# EasyEDA Pro project 遥控器(433+红外).eprj

# Schematic Schematic1

## Sheets
1 P1: Create Date: 2022-12-18; Page Name: P1; Project Name: 遥控器(433+红外); Schematic Name: Schematic1; Update Date: 2022-12-21; Company: 嘉立创EDA; Page Size: A4; Version: V1.0
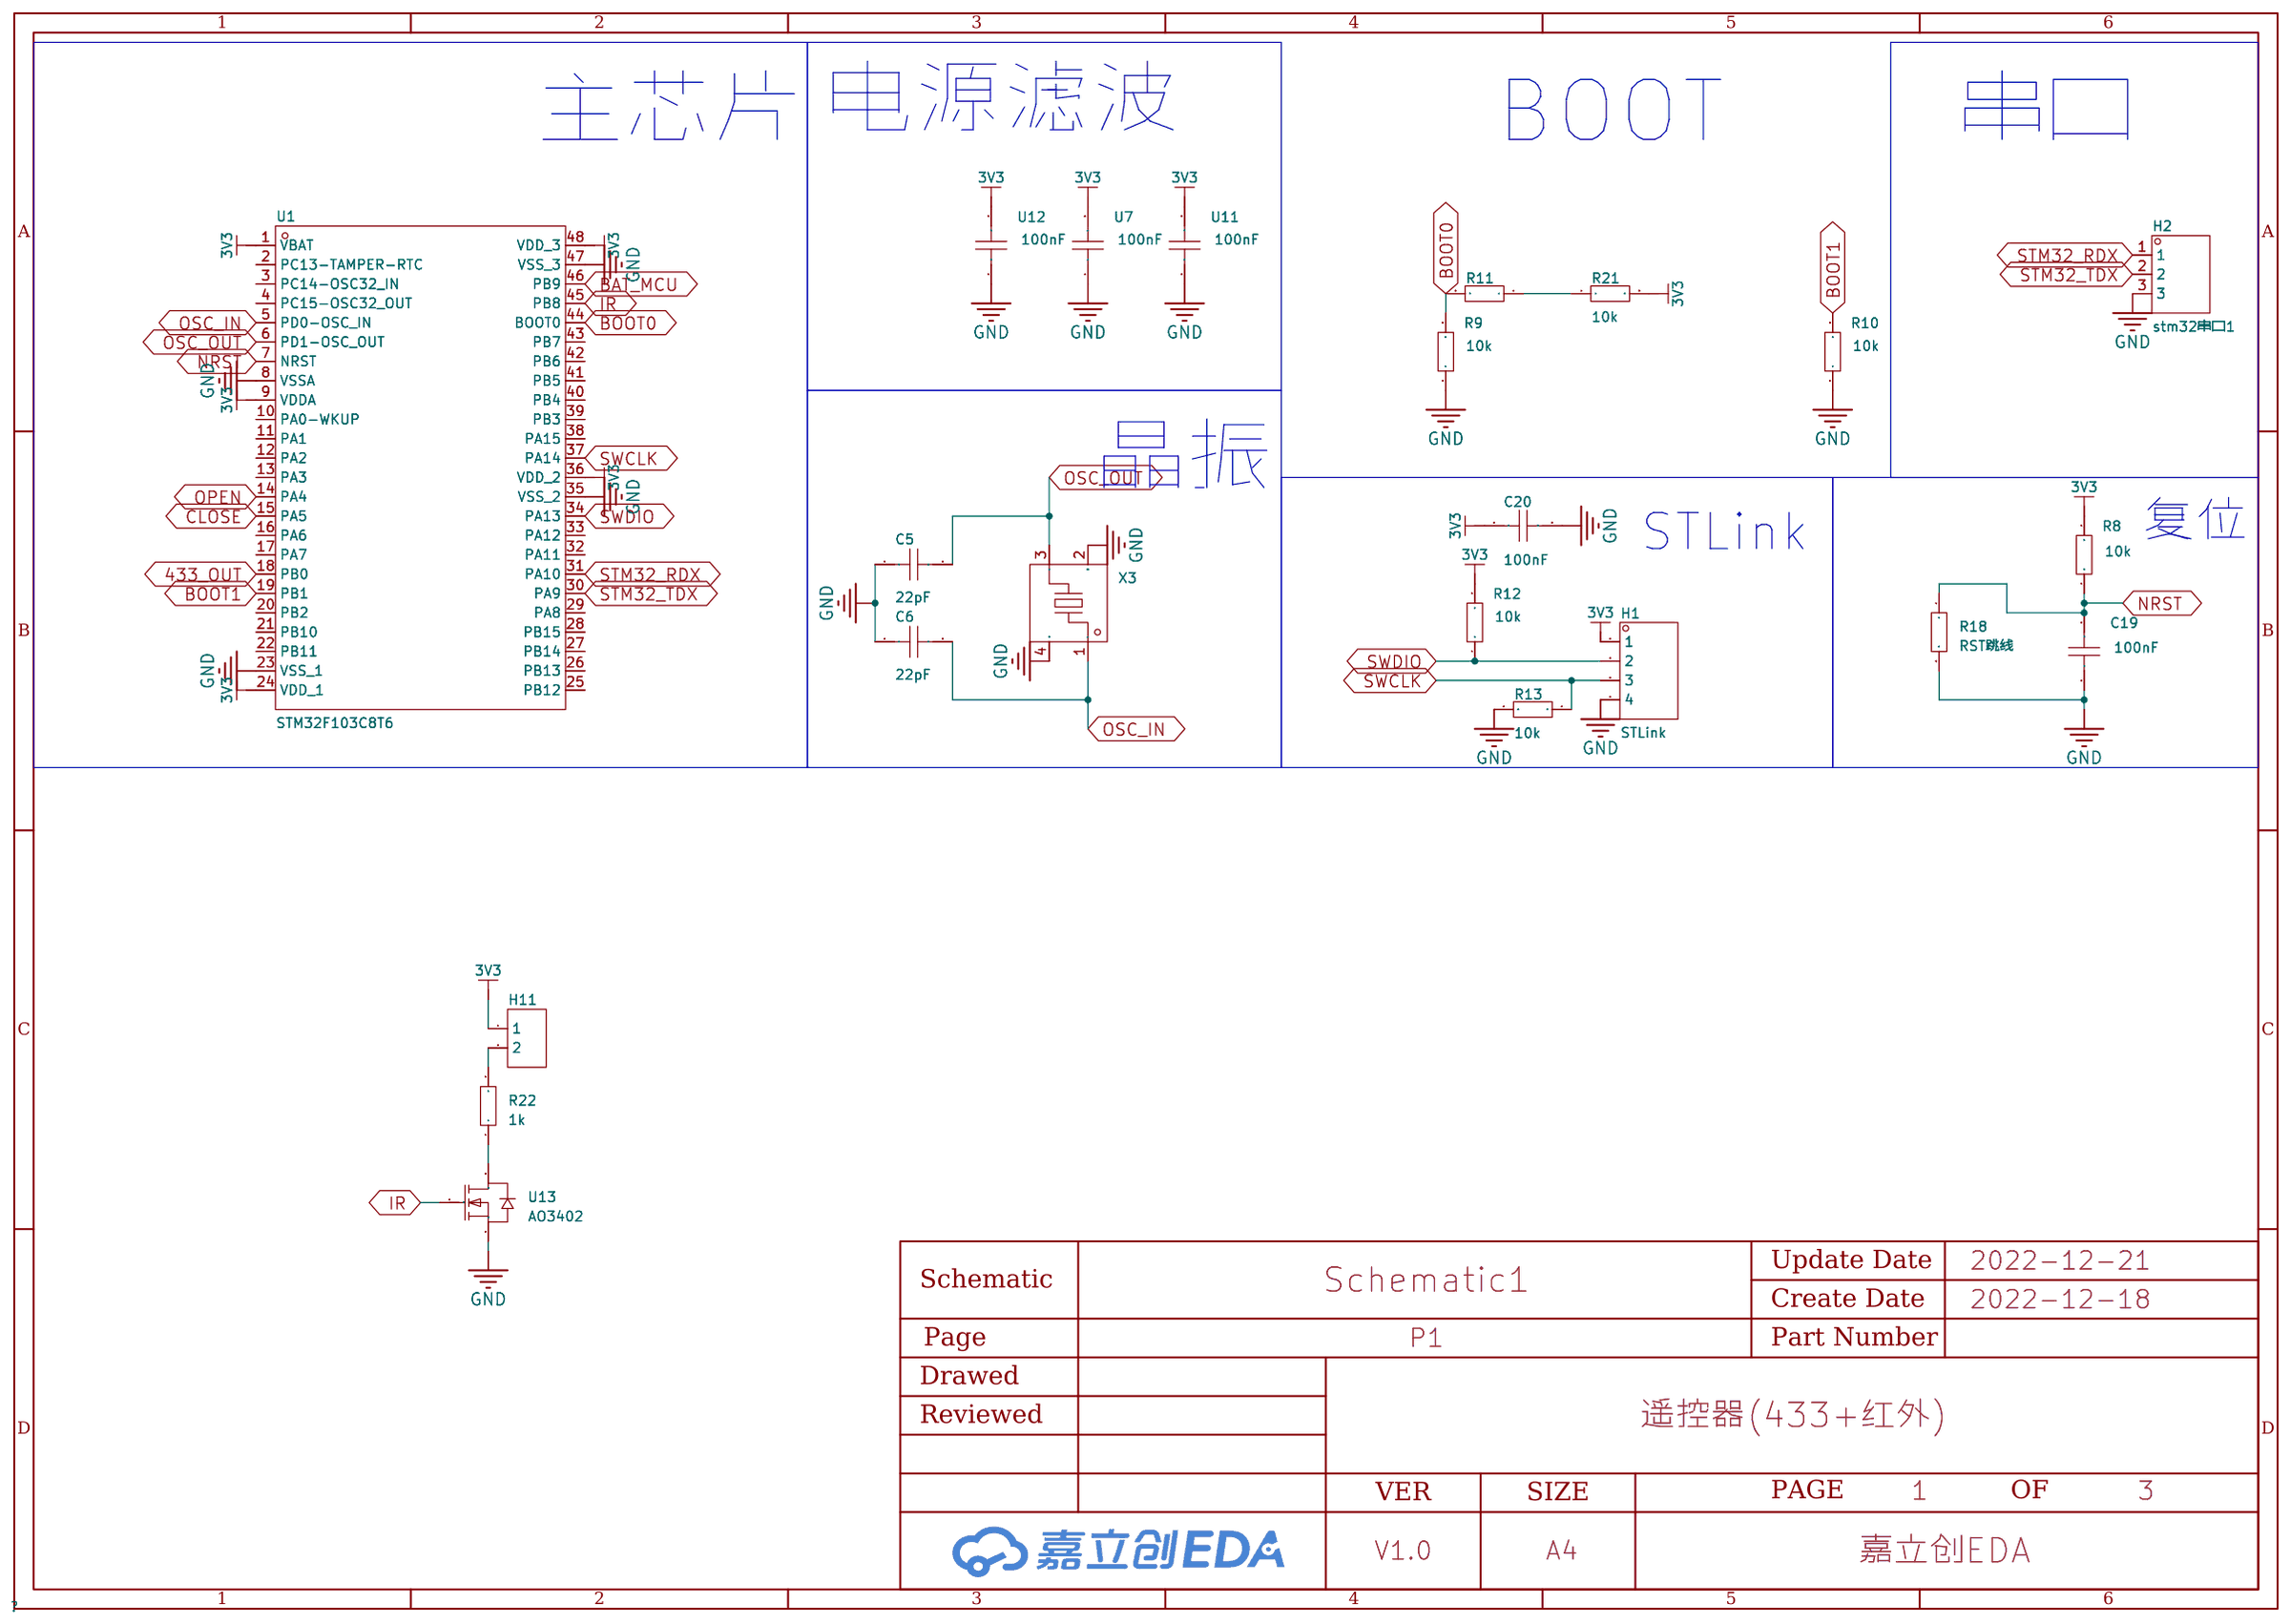
[diagram p0: P1]
2 P2: Page Name: P2; Update Date: 2023-01-12
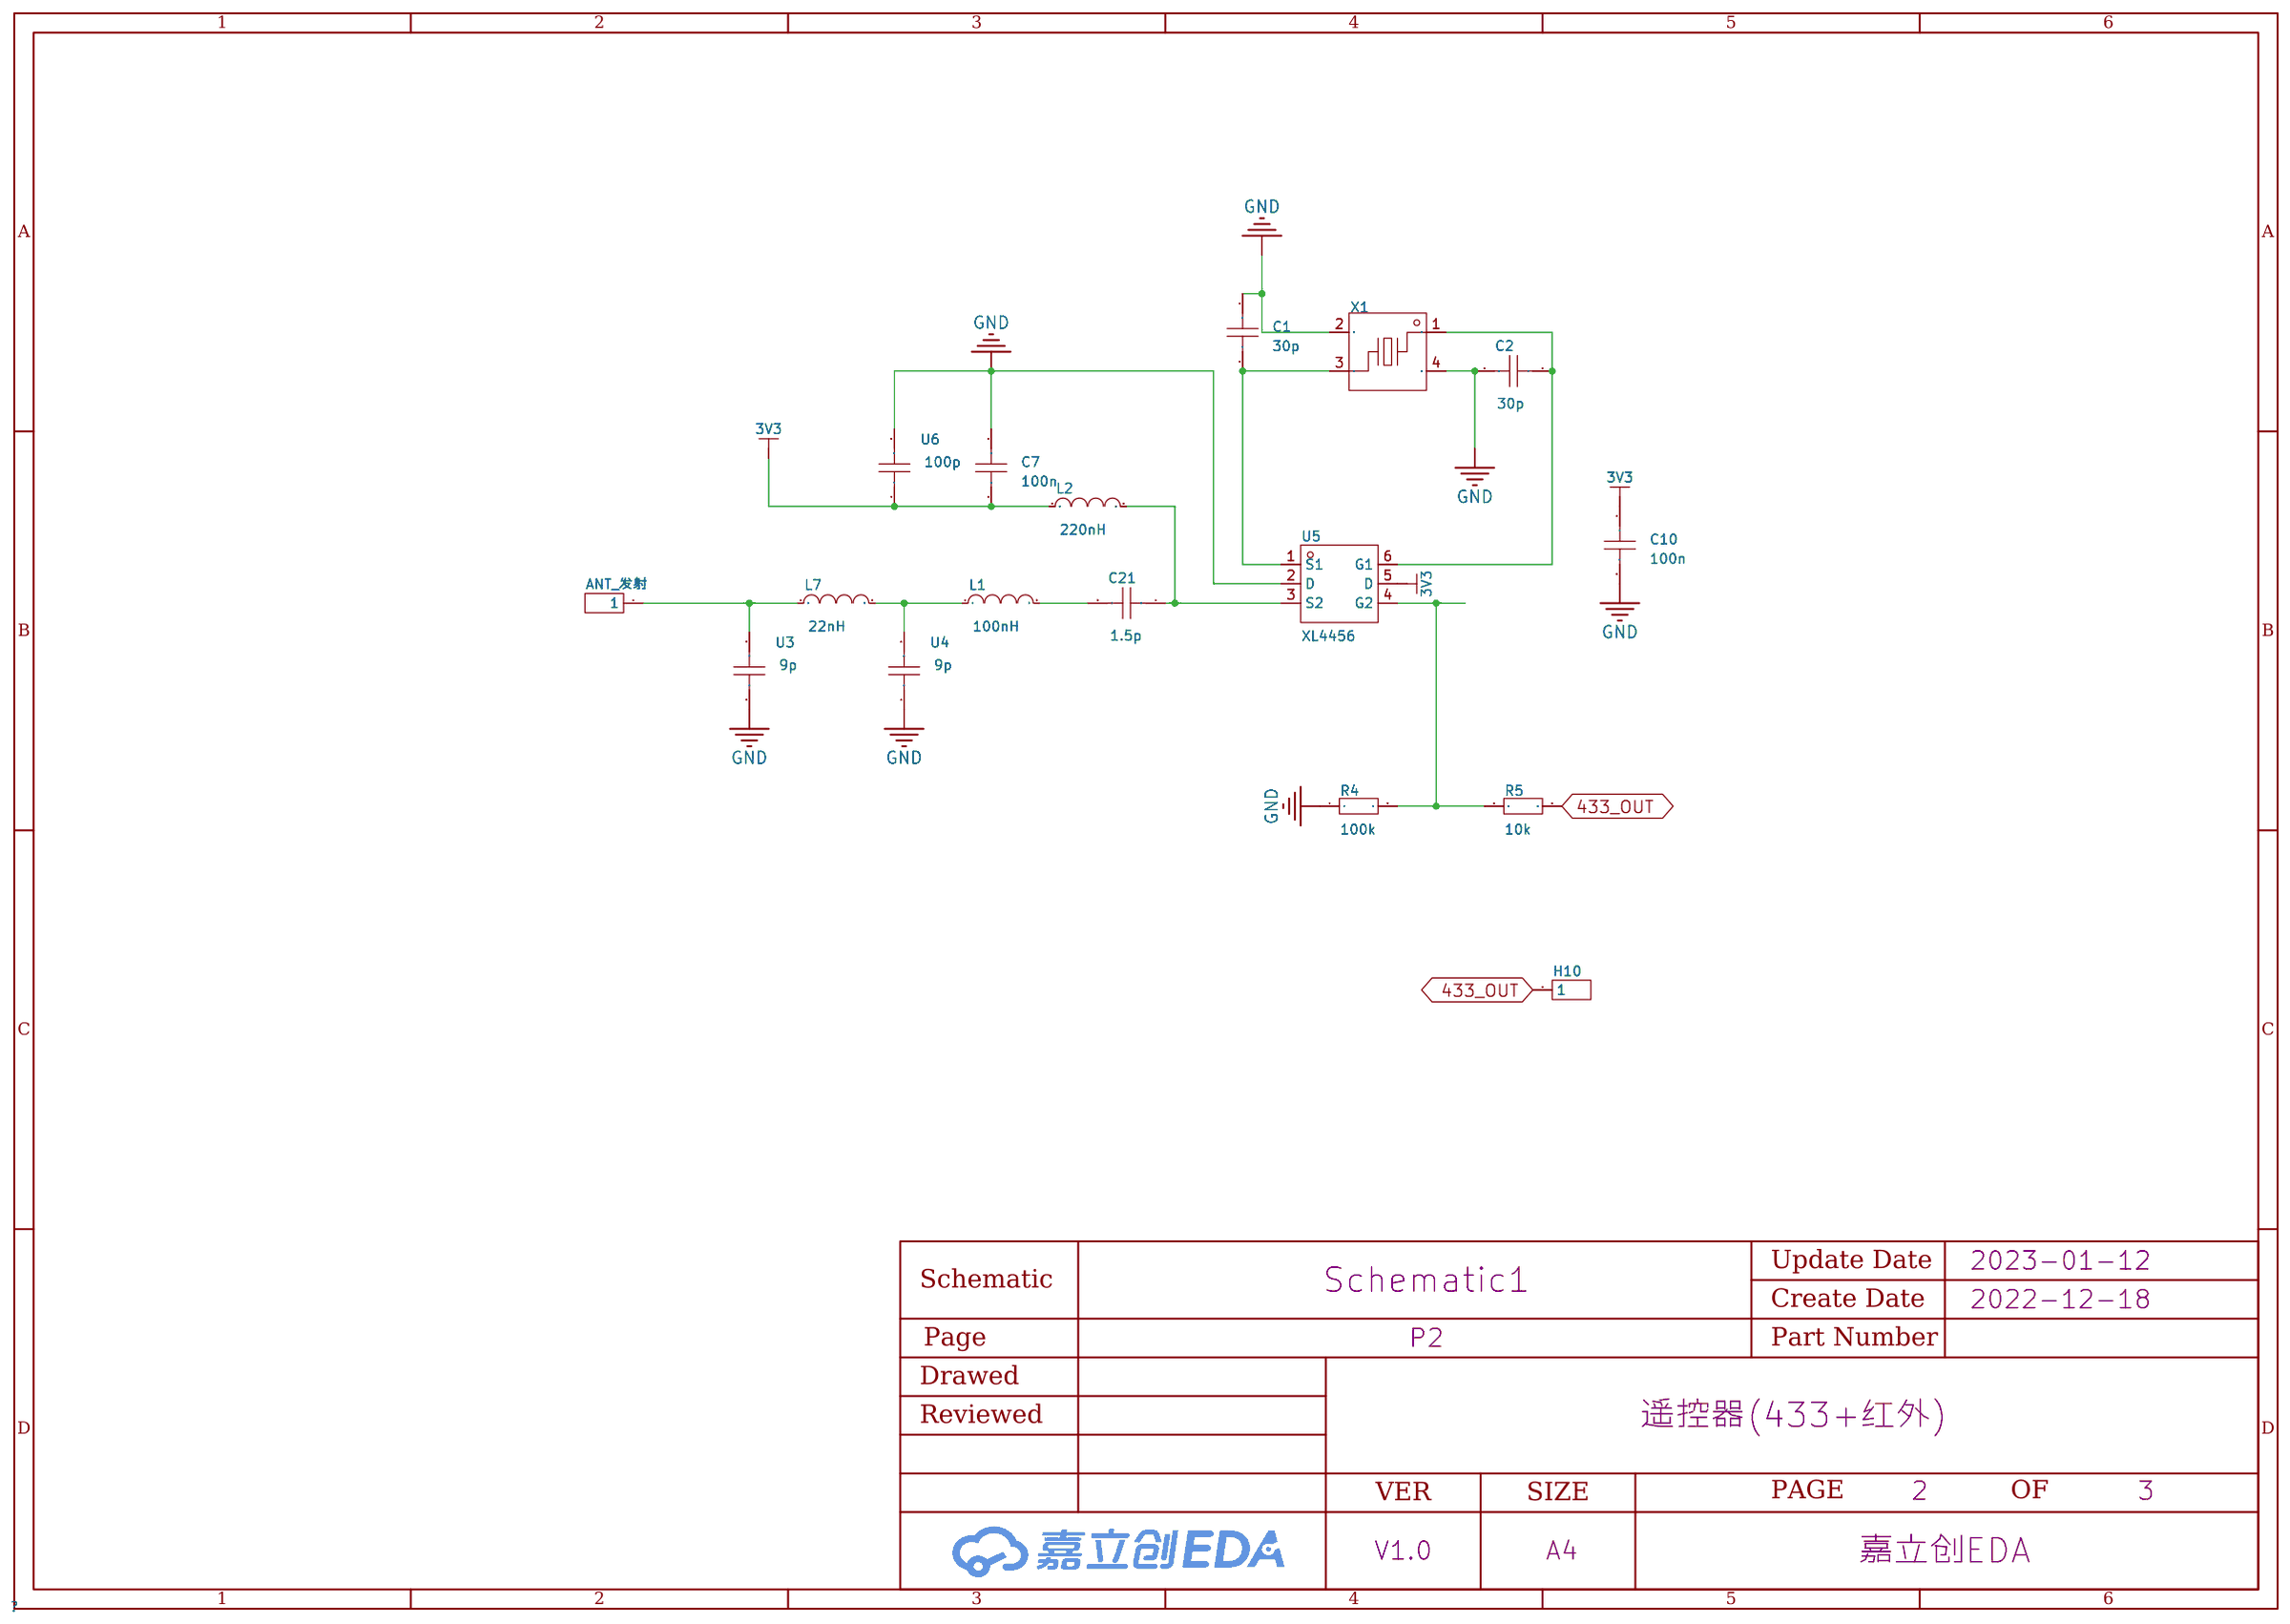
[diagram p1: P2]
3 电源: Page Name: 电源; Update Date: 2022-12-20
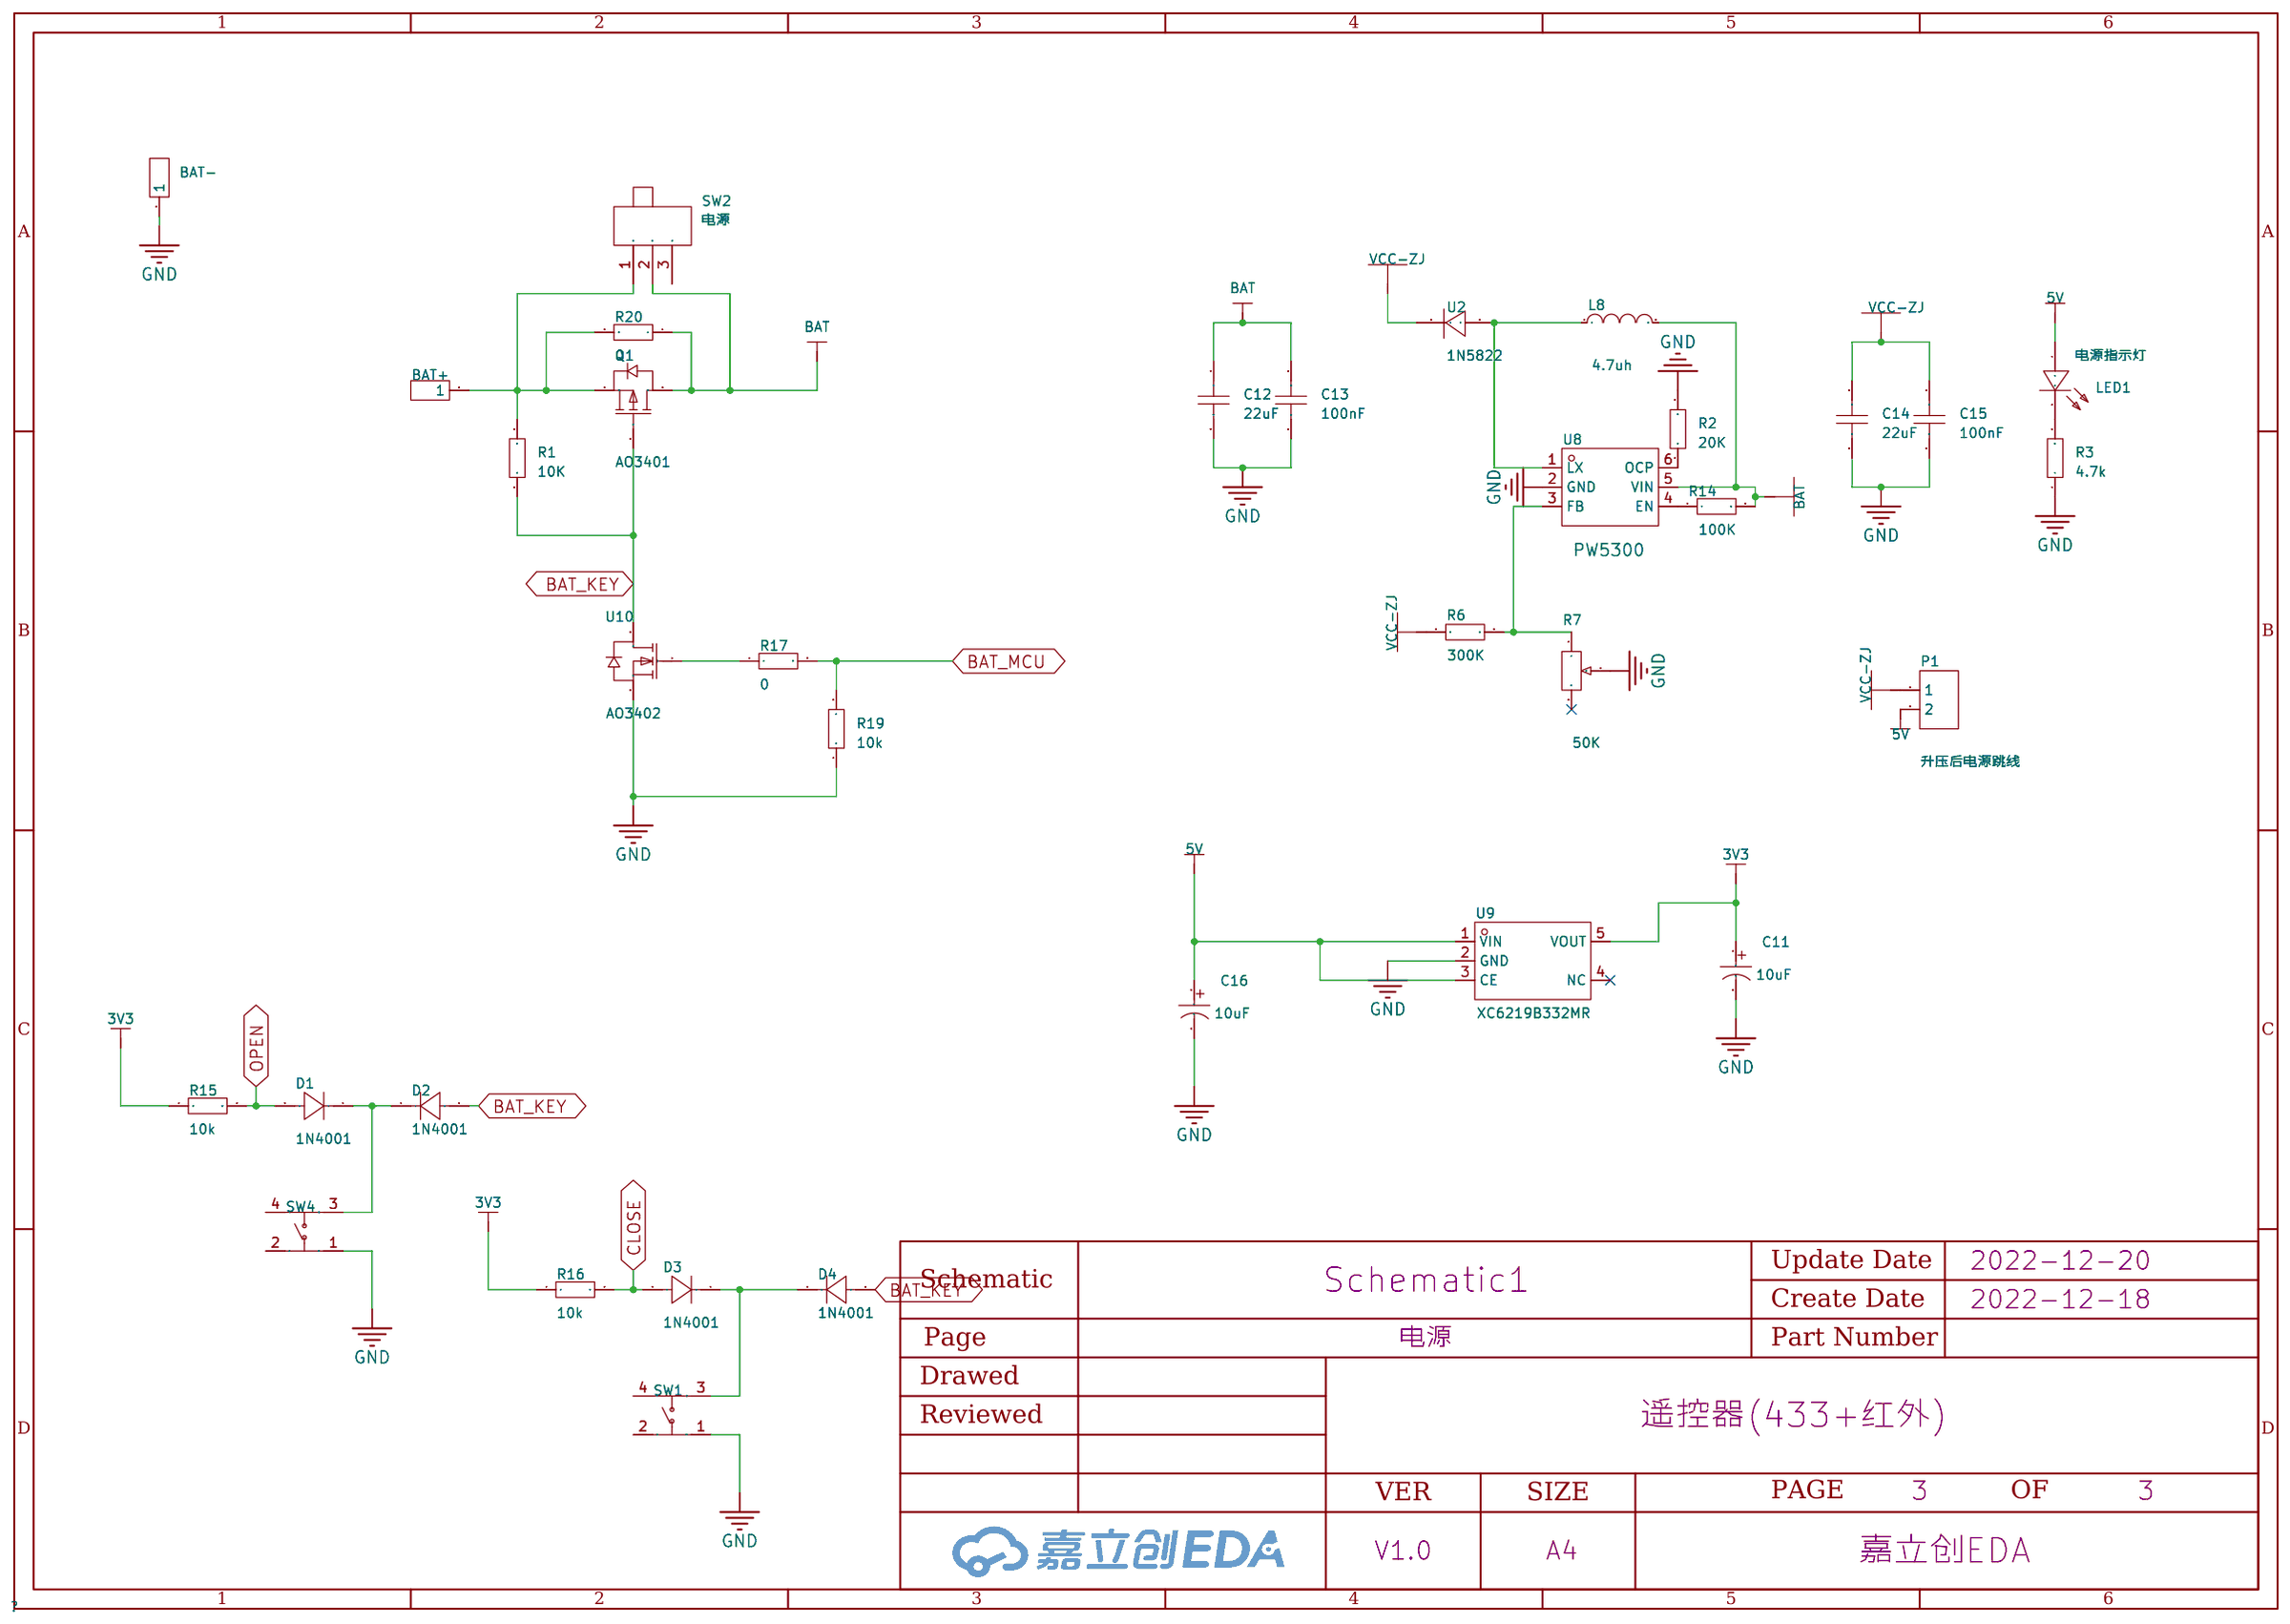
[diagram p2: 电源]

## Parts
sheet P1
C5  22pF  [C0805]
C6  22pF  [C0805]
C19  100nF  [C0603]
C20  100nF  [C0603]
H1  STLink  [HDR-TH_4P-P2.54-V-M]
H2  stm32串口1  [HDR-TH_3P-P2.54-V-M-1]
H11  -  [HDR-TH_2P-P2.54-V-F]
R8  10k  [R0603]
R9  10k  [R0603]
R10  10k  [R0603]
R11  boot0跳线  [R0603]
R12  10k  [R0603]
R13  10k  [R0603]
R18  RST跳线  [R0603]
R21  10k  [R0603]
R22  1k  [R0805]
U1  STM32F103C8T6  [LQFP-48_L7.0-W7.0-P0.50-LS9.0-BL]
U7  100nF  [C0603]
U11  100nF  [C0603]
U12  100nF  [C0603]
U13  AO3402  [SOT-23-3_L2.9-W1.3-P1.90-LS2.4-BR]
X3  NX3225SA-26MHz-STD-CSR-6  [CRYSTAL-SMD_4P-L3.2-W2.5-BL]
sheet P2
ANT_发射  -  [HDR-TH_1P-V-M_XKB_X4611WV-01I-C28D40]
C1  30p  [C0805]
C2  30p  [C0805]
C7  100n  [C0805]
C10  100n  [C0805]
C21  1.5p  [C0805]
H10  -  [HDR-TH_1P-V-M_XKB_X4611WV-01I-C28D40]
L1  100nH  [IND-SMD_L1.7-W1.0-SCW1608C39NJST]
L2  220nH  [IND-SMD_L1.7-W1.0-SCW1608C39NJST]
L7  22nH  [IND-SMD_L1.7-W1.0-SCW1608C39NJST]
R4  100k  [R0805]
R5  10k  [R0805]
U3  9p  [C0603]
U4  9p  [C0603]
U5  XL4456  [SOT-23-6_L2.9-W1.6-P0.95-LS2.9-BL]
U6  100p  [C0603]
X1  NX3225SA-26MHz-STD-CSR-6  [CRYSTAL-SMD_4P-L3.2-W2.5-BL]
sheet 电源
BAT+  -  [HDR-TH_1P-P2.54-V-M]
BAT-  -  [HDR-TH_1P-P2.54-V-M]
C11  10uF  [CAP-TH_BD5.0-P2.00-D0.8-FD]
C12  22uF  [C0805]
C13  100nF  [C0805]
C14  22uF  [C0805]
C15  100nF  [C0805]
C16  10uF  [CAP-TH_BD5.0-P2.00-D0.8-FD]
D1  1N4001  [SMA_L4.2-W2.6-LS5.0-RD]
D2  1N4001  [SMA_L4.2-W2.6-LS5.0-RD]
D3  1N4001  [SMA_L4.2-W2.6-LS5.0-RD]
D4  1N4001  [SMA_L4.2-W2.6-LS5.0-RD]
L8  1uH  [IND-SMD_L4.0-W4.0]
LED1  电源指示灯  [LED0805-R-RD]
P1  升压后电源跳线  [HDR-TH_2P-P2.54-V-F]
Q1  AO3401  [SOT-23-3_L2.9-W1.6-P1.90-LS2.8-BR]
R1  10K  [R0603]
R2  20K  [R0805]
R3  4.7k  [R0805]
R6  300K  [R0805]
R7  50K  [RES-ADJ-TH_3P_L9.6-W4.8-P2.50-L]
R14  100K  [R0805]
R15  10k  [R0603]
R16  10k  [R0603]
R17  0  [R0805]
R19  10k  [R0603]
R20  0  [R0805]
SW1  MPU6050  [SW-SMD_4P-L6.0-W6.0-P4.50-LS9.0-2]
SW2  电源  [SW-TH_MK-12D18-G040]
SW4  MPU6050  [SW-SMD_4P-L6.0-W6.0-P4.50-LS9.0-2]
U2  1N5822  [SMA_L4.3-W2.5-LS5.0-FD]
U8  PW5300  [SOT-23-6_L2.9-W1.6-P0.95-LS2.8-BL]
U9  XC6219B332MR  [SOT-23-5_L2.9-W1.6-P0.95-LS2.8-BR]
U10  AO3402  [SOT-23-3_L2.9-W1.3-P1.90-LS2.4-BR]

## Library data of the parts
C1 C2 C5-C7 C10 C12-C15 C21 = 0805: Supplier Part: C9900012713; JLCPCB Part Class: Extended Part; Datasheet: https://atta.szlcsc.comnull; Supplier: LCSC
C19 C20 = 0805: Supplier Part: C9900012713; Supplier Footprint: C0805; JLCPCB Part Class: Extended Part; Datasheet: https://atta.szlcsc.comnull; Supplier: LCSC
H1 = B-2100S04P-A110: 间距:2.54mm;总PIN位数:4;排数:1;插针结构:1x4P;行距:-;安装类型:直插;圆针/方针:-;额定电流:-;额定电压:-;配合针长度:6mm;塑高:2.54mm;端接针长度:3mm;触头材质:黄铜;触头镀层:-;工作温度范围:-40~+105;颜色:黑色;; LCSC Part Name: 2.54mm 1x4P; Supplier Part: C124378; Manufacturer: Ckmtw(灿科盟); Supplier Footprint: 插件,P=2.54mm; JLCPCB Part Class: Extended Part; Datasheet: https://atta.szlcsc.com/upload/public/pdf/source/20170821/C124378_1503303307508901532.pdf; Supplier: LCSC; Pitch: 2.54mm; Number of Pins: 4; Number of Rows: 1; Pin Structure: 1x4P; Mounting Type: 直插; Length of Mating Pin: 6mm; Insulation Height: 2.54mm; Length of End Connection Pin: 3mm; Contact Material: 黄铜; Operating Temperature Range: -40~+105; Color: 黑色
H2 = 77311-102-03LF: 间距:2.54mm;总PIN位数:3;排数:1;插针结构:-;行距:-;安装类型:直插;圆针/方针:-;额定电流:-;额定电压:-;配合针长度:-;塑高:-;触头材质:磷青铜;触头镀层:-;颜色:黑色;; LCSC Part Name: 2.54mm; Supplier Part: C180248; Manufacturer: Amphenol; Supplier Footprint: 插件,P=2.54mm; JLCPCB Part Class: Extended Part; Datasheet: https://atta.szlcsc.com/upload/public/pdf/source/20180329/C180248_62E264527695F7ED58561BB828D45E42.pdf; Supplier: LCSC; Pitch: 2.54mm; Number of Pins: 3; Number of Rows: 1; Mounting Type: 直插; Contact Material: 磷青铜; Color: 黑色
H11 = HDR-F_2.54_1x2P: Supplier Part: C49661; Supplier Footprint: 插件
R1 R8-R13 R15 R16 R18 R19 R21 = 0805: Supplier Part: C9900012715; Supplier Footprint: R0805; JLCPCB Part Class: Extended Part; Datasheet: https://atta.szlcsc.comnull; Supplier: LCSC
R2-R6 R14 R17 R20 R22 = 0805: Supplier Part: C9900012715; JLCPCB Part Class: Extended Part; Datasheet: https://atta.szlcsc.comnull; Supplier: LCSC
U1 = STM32F103C8T6: CPU位数:32-Bit;ROM类型:FLASH;CPU内核:ARM® Cortex®-M3;主频（MAX):72MHz;工作电压:2V ~ 3.6V;; LCSC Part Name: STM32F103C8T6 MSL=3; Supplier Part: C8734; Manufacturer: ST(意法半导体); Supplier Footprint: LQFP-48_7x7x05P; JLCPCB Part Class: Basic Part; Datasheet: https://atta.szlcsc.com/upload/public/pdf/source/20140724/1457707174202.pdf; Supplier: LCSC; Core Size: 32-Bit; Program Memory Type: FLASH; Core Processor: ARM® Cortex®-M3; Speed: 72MHz; Voltage - Supply (Vcc/Vdd): 2V ~ 3.6V; Program Memory Size: 64KB; RAM Size: 20KB; Number of I/O: 37; A/D: 10x12bit; D/A: 0; PWM: 13; LCD: 0; UART/USART: 3 USART; SPI: 2; I2C（SMBUS/PMBUS）: 2; USB Device: 1; CAN: 1; Ethernet: 0
U7 U11 U12 = 1nF-C0603: Supplier Part: C2940049; JLCPCB Part Class: Extended Part; Supplier: LCSC
U10 U13 = AO3402_1: Supplier Part: C5148472; Manufacturer: BORN(伯恩半导体); Supplier Footprint: SOT-23; Datasheet: https://atta.szlcsc.com/upload/public/pdf/source/20220830/7392F372FF743390FFC8C1B184742D3D.pdf; Supplier: LCSC
X1 X3 = NX3225SA-26MHz-STD-CSR-6: LCSC Part Name: NX3225SA 26MHz 8pF ±15ppm ?40 to +85 °C; Supplier Part: C880099; Manufacturer: NDK; Supplier Footprint: 3225; JLCPCB Part Class: Extended Part; Datasheet: https://atta.szlcsc.com/upload/public/pdf/source/20171201/C156252_15121213466341157580.pdf; Supplier: LCSC
ANT_发射 H10 = HDR-M_2.54_1x1P: Supplier Part: C81276; Supplier Footprint: 插件; JLCPCB Part Class: Extended Part
L1 L2 L7 = L0603: Supplier Part: C9900016892; Supplier Footprint: 16nH/±2%/0603; JLCPCB Part Class: Extended Part; Datasheet: https://atta.szlcsc.comnull; Supplier: LCSC
U3 U4 U6 = 104P: Supplier Part: C9900009971; JLCPCB Part Class: Extended Part; Datasheet: https://atta.szlcsc.comnull; Supplier: LCSC
U5 = JMTM8205A: LCSC Part Name: 贴片MOS管; Supplier Part: C5173657; Manufacturer: JJW(捷捷微); Supplier Footprint: SOT23-6L; Datasheet: https://atta.szlcsc.com/upload/public/pdf/source/20220916/99A365091B307E9B4FA2C8643662B7D1.pdf; Supplier: LCSC
BAT+ BAT- = 2.54-1*1P针: 间距:-;总PIN位数:1;排数:1;插针结构:-;行距:-;安装类型:直插;圆针/方针:-;额定电流:-;额定电压:-;配合针长度:-;塑高:-;触头材质:-;触头镀层:-;颜色:黑色;; LCSC Part Name: 1x1P; Supplier Part: C81276; Manufacturer: BOOMELE(博穆精密); Supplier Footprint: 插件; JLCPCB Part Class: Extended Part; Supplier: LCSC; Number of Pins: 1; Number of Rows: 1; Mounting Type: 直插; Color: 黑色
C11 C16 = KM106M025D11RR0VH2FP0: 脚间距:2mm;额定电压:25V;纹波电流:38mA 120Hz;等效串联电阻:-;精度:±20%;电容体直径:5mm;工作温度:-;电容体长度:11mm;容值:10uF;工作寿命:1000hrs 105;; LCSC Part Name: 10uF 25V; Supplier Part: C43347; Manufacturer: CX(承兴); Supplier Footprint: 径向引线,5x11mm; JLCPCB Part Class: Extended Part; Datasheet: https://atta.szlcsc.com/upload/public/pdf/source/20151029/1457707524171.pdf; Supplier: LCSC; Lead Spacing: 2mm; Rated Voltage: 25V; Ripple Current: 38mA 120Hz; Tolerance: ±20%; φD: 5mm; L: 11mm; Lifetime @ Temp: 1000hrs 105
D1-D4 = 1N4001_C2909965: 二极管配置:独立式;直流反向耐压(Vr):50V;平均整流电流(Io):1A;正向压降(Vf):1.1V@1A;反向电流(Ir):5uA@50V;; LCSC Part Name: 50V 1A 1.1V@1A; Supplier Part: C2909965; Manufacturer: YONGYUTAI(永裕泰); Supplier Footprint: SMA; JLCPCB Part Class: Extended Part; Datasheet: https://atta.szlcsc.com/upload/public/pdf/source/20211027/5AE7E905FA0C08CC7DD61360253C0AAD.pdf; Supplier: LCSC; Diode Configuration: 独立式; Reverse Voltage (Vr): 50V; Average Rectified Current (Io): 1A; Forward Voltage (Vf@If): 1.1V@1A; Reverse Leakage Current: 5uA@50V
L8 = YNR4020-1R0N: 电感值:1uH;精度:±30%;额定电流:2.15A;直流电阻(DCR):29mΩ;; LCSC Part Name: 1uH ±30% 2.15A 29mΩ; Supplier Part: C340375; Manufacturer: YJYCOIN(益嘉源); Supplier Footprint: SMD,4x4x2mm; JLCPCB Part Class: Extended Part; Datasheet: https://atta.szlcsc.com/upload/public/pdf/source/20200623/C340375_E3C7D09D28938DE90BB2FC3D8012D7E7.pdf; Supplier: LCSC; Tolerance: ±30%; Rated Current: 2.15A; DC Resistance (DCR): 29mΩ
LED1 = NCD0805G1: 发光颜色:翠绿;; LCSC Part Name: 翠绿; Supplier Part: C84260; Manufacturer: 国星光电; Supplier Footprint: 0805; JLCPCB Part Class: Extended Part; Datasheet: https://atta.szlcsc.com/upload/public/pdf/source/20200820/C84260_AFC7BF57C6FBA034D182BB8D10A67EFE.pdf; Supplier: LCSC; Emitted Color: 翠绿
P1 = 2.54-1*2P母: 间距:2.54mm;总孔位数:2;排数:1;插孔结构:1x2P;行距:-;安装类型:直插;塑高:-;触头材质:-;触头镀层:-;; LCSC Part Name: 2.54mm; Supplier Part: C49661; Manufacturer: BOOMELE(博穆精密); Supplier Footprint: 插件,P=2.54mm; JLCPCB Part Class: Extended Part; Datasheet: https://atta.szlcsc.com/upload/public/pdf/source/20151109/1457707570988.pdf; Supplier: LCSC; Pitch: 2.54mm; Number of Holes: 2; Number of Rows: 1; Holes Structure: 1x2P; Mounting Type: 直插
Q1 = AO3401_C688915: 类型:P沟道;漏源电压(Vdss):30V;连续漏极电流(Id):4.2A;功率(Pd):1.2W;导通电阻(RDS(on)@Vgs,Id):50mΩ@10V,4.2A;阈值电压(Vgs(th)@Id):1V@250uA;栅极电荷(Qg@Vgs):9.5nC@4.5V;输入电容(Ciss@Vds):950pF@15V;反向传输电容(Crss@Vds):75pF@15V;工作温度:+150@(Tj);; LCSC Part Name: P沟道 30V 4.2A; Supplier Part: C688915; Manufacturer: LGE(鲁光); Supplier Footprint: SOT-23; JLCPCB Part Class: Extended Part; Datasheet: https://atta.szlcsc.com/upload/public/pdf/source/20200622/C688915_14CA049379670312E9F9920C23D236FF.pdf; Supplier: LCSC; Type: P沟道; Drain Source Voltage (Vdss): 30V; Continuous Drain Current (Id): 4.2A; Power Dissipation (Pd): 1.2W; Drain Source On Resistance (RDS(on)@Vgs,Id): 50mΩ@10V,4.2A; Gate Threshold Voltage (Vgs(th)@Id): 1V@250uA; Total Gate Charge (Qg@Vgs): 9.5nC@4.5V; Input Capacitance (Ciss@Vds): 950pF@15V; Reverse Transfer Capacitance (Crss@Vds): 75pF@15V; Operating Temperature: +150@(Tj)
R7 = CT-94EW101: LCSC Part Name: 精密微调电位器; Supplier Part: C2921723; Manufacturer: NIDEC(尼得科); Datasheet: https://atta.szlcsc.com/upload/public/pdf/source/20220428/BCD71A11115097FFA8DDC1F10694635D.pdf; Supplier: LCSC
SW1 SW4 = KH-6X6X5H-STM: 触点电流:50mA;额定电压(DC):12V;电路结构:单刀单掷;安装方式:立贴;按钮形状:圆形按钮;按钮/盖帽颜色:黑色;机械寿命:80000;引脚样式:鸥翼型;开关长度:6mm;开关宽度:6mm;开关高度:5mm;带支架:否;; Supplier Part: C2837531; Manufacturer: kinghelm(金航标); Supplier Footprint: SMD; JLCPCB Part Class: Extended Part; Datasheet: https://atta.szlcsc.com/upload/public/pdf/source/20210608/C2837531_45E87AB996CE723B09405FF2EA209C4C.pdf; Supplier: LCSC; Contact Current: 50mA; Voltage Rating (DC): 12V; Circuit: 单刀单掷; Mounting Style: 立贴; Actuator Style: 圆形按钮; Actuator/Cap Color: 黑色; Mechanical Life: 80000; Pin Style: 鸥翼型; Switch Length: 6mm; Switch Width: 6mm; Switch Height: 5mm; Strike Gundam: 否
SW2 = MK-12D18-G020: LCSC Part Name: 边三脚微型拨动开关G4; Supplier Part: C3019727; Manufacturer: G-Switch(品赞); Supplier Footprint: 插件; JLCPCB Part Class: Extended Part; Datasheet: https://atta.szlcsc.com/upload/public/pdf/source/20201201/C963202_825FB742C5BA766BED52E1DDA96DE5A3.pdf; Supplier: LCSC
U2 = SMAJ12ASMA: Supplier Part: C9900010881; Supplier Footprint: SMA(单向）; JLCPCB Part Class: Extended Part; Datasheet: https://atta.szlcsc.comnull; Supplier: LCSC
U8 = PW5300: Supplier Part: C9900019345; Supplier Footprint: SOT-23-6; JLCPCB Part Class: Extended Part; Datasheet: https://atta.szlcsc.comnull; Supplier: LCSC
U9 = XC6219B332MR: Supplier Part: C2940621; Manufacturer: TECH PUBLIC(台舟); Supplier Footprint: SOT-23-5; JLCPCB Part Class: Extended Part; Datasheet: https://atta.szlcsc.com/upload/public/pdf/source/20220110/54F04FDDA047AFA0B6C67160FF1F02B5.pdf; Supplier: LCSC

## Nets
3V3: C7.2 C10.1 C11.1 C20.1 H1.1 H11.1 L2.1 R8.2 R12.2 R15.1 R16.1 R21.2 U1.1(VBAT) U1.9(VDDA) U1.24(VDD_1) U1.36(VDD_2) U1.48(VDD_3) U5.5(D) U6.1 U7.2 U9.5(VOUT) U11.2 U12.2
5V: C16.1 LED1.1(A) P1.2 U9.1(VIN) U9.3(CE)
GND: BAT-.1 C1.1 C2.2 C5.1 C6.1 C7.1 C10.2 C11.2 C12.2 C13.2 C14.2 C15.2 C16.2 C19.2 C20.2 H1.4 H2.3 R2.2 R3.1 R4.1 R7.2 R9.1 R10.1 R13.2 R18.2 R19.1 SW1.1 SW4.1 U1.8(VSSA) U1.23(VSS_1) U1.35(VSS_2) U1.47(VSS_3) U3.1 U4.1 U5.2(D) U6.2 U7.1 U8.2(GND) U9.2(GND) U10.2(S) U11.1 U12.1 U13.2(S) X1.2(GND) X1.4(GND) X3.2(GND) X3.4(GND)
VCC-ZJ: C14.1 C15.1 P1.1 R6.1 U2.2(K)
433_OUT: H10.1 R5.2 U1.18(PB0)
BAT: C12.1 C13.1 L8.2 Q1.3(D) R14.2 R20.1 SW2.2 U8.5(VIN)
BAT_KEY: D2.2(A) D4.2(A) Q1.1(G) R1.2 U10.3(D)
BAT_MCU: R17.2 R19.2 U1.46(PB9)
BOOT0: R9.2 R11.2 U1.44(BOOT0)
BOOT1: R10.2 U1.19(PB1)
CLOSE: D3.2(A) R16.2 U1.15(PA5)
IR: U1.45(PB8) U13.1(G)
NRST: C19.1 R8.1 R18.1 U1.7(NRST)
OPEN: D1.2(A) R15.2 U1.14(PA4)
OSC_IN: C6.2 U1.5(PD0-OSC_IN) X3.1
OSC_OUT: C5.2 U1.6(PD1-OSC_OUT) X3.3
STM32_RDX: H2.1 U1.31(PA10)
STM32_TDX: H2.2 U1.30(PA9)
SWCLK: H1.3 R13.1 U1.37(PA14)
SWDIO: H1.2 R12.1 U1.34(PA13)
$1N2585: R11.1 R21.1
$1N7140: R22.1 U13.3(D)
$1N7169: H11.2 R22.2
$2N807: ANT_发射.1 L7.1 U3.2
$2N808: L1.1 L7.2 U4.2
$2N809: C21.2 L1.2
$2N810: C21.1 L2.2 U5.3(S2)
$2N822: R4.2 R5.1 U5.4(G2)
$3N1267: L8.1 U2.1(A) U8.1(LX)
$3N1270: R14.1 U8.4(EN)
$3N1272: R2.1 U8.6(OCP)
$3N1276: R6.2 R7.1 U8.3(FB)
$3N1281: LED1.2(K) R3.2
$3N5242: BAT+.1 Q1.2(S) R1.1 R20.2 SW2.1
$3N6252: D1.1(K) D2.1(K) SW4.3
$3N7467: D3.1(K) D4.1(K) SW1.3
$3N7940: R17.1 U10.1(G)
Net-(C1-2): C1.2 U5.1(S1) X1.3
Net-(C2-1): C2.1 U5.6(G1) X1.1

Not connected (* = marked no-connect by the designer): R7 3*; SW1 2 4; SW2 3; SW4 2 4; U1 2(PC13-TAMPER-RTC) 3(PC14-OSC32_IN) 4(PC15-OSC32_OUT) 10(PA0-WKUP) 11(PA1) 12(PA2) 13(PA3) 16(PA6) 17(PA7) 20(PB2) 21(PB10) 22(PB11) 25(PB12) 26(PB13) 27(PB14) 28(PB15) 29(PA8) 32(PA11) 33(PA12) 38(PA15) 39(PB3) 40(PB4) 41(PB5) 42(PB6) 43(PB7); U9 4(NC)*

## Notes on the sheets
sheet 1
- 主芯片
- 电源滤波
- BOOT
- 串口
- 晶振
- 复位
- STLink

# Board PCB1
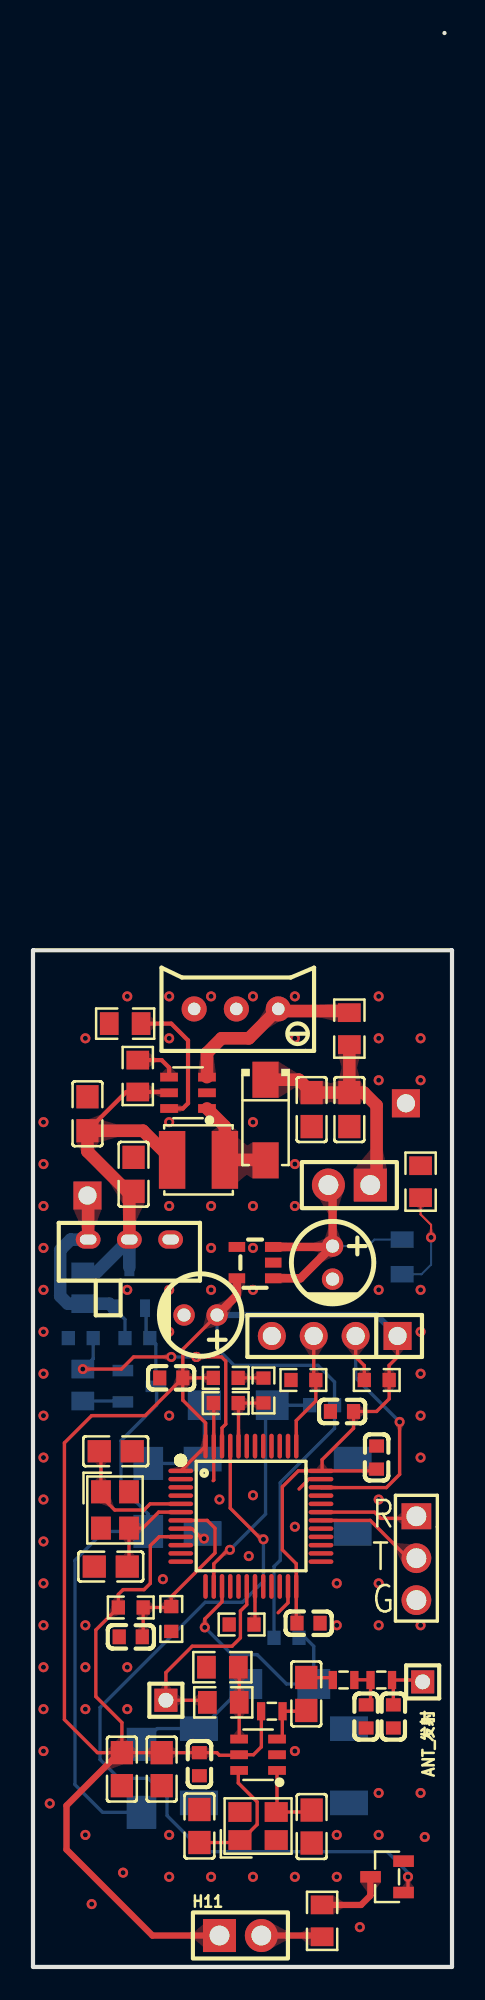
[diagram p3: board, top side]
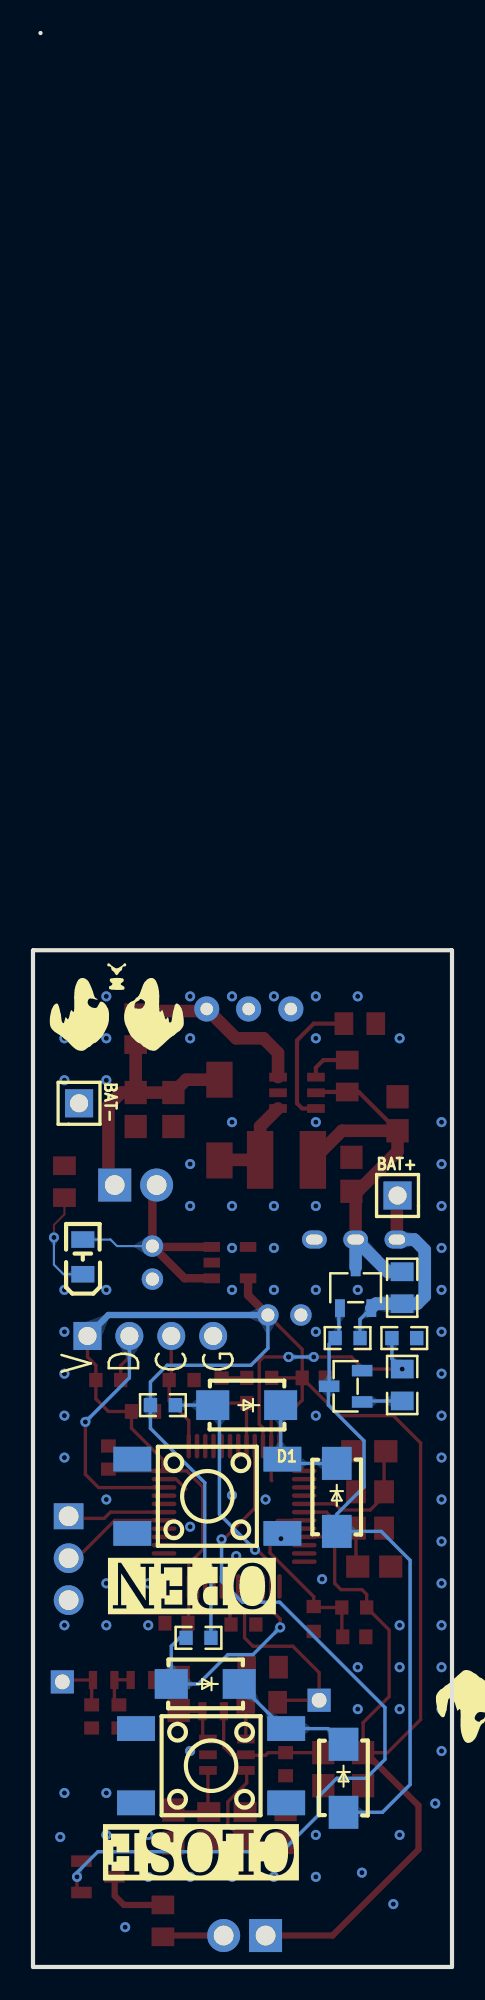
[diagram p4: board, bottom side, seen from below]

Outline 25.4 x 117.16 mm; copper layers: Top Layer, Bottom Layer. Coordinates in mm from the lower left corner of the outline.
Outline path: rectangle 24.94,117.16 24.95,117.16 ; 0,61.58 0,0.02 arc(0.01,0.01) 0.02,0 25.38,0 arc(25.39,0.01) 25.4,0.02 25.4,61.58 arc(25.39,61.59) 25.38,61.59 0.02,61.59 arc(0.01,61.59) 0,61.58
Stack: Top Layer 0.035mm / Dielectric1 1.51mm FR4 er 4.5 / Bottom Layer 0.035mm

## Design rules (mm)
spacing safeClearance (default): track to track 0.152, other pairs 0.152 to 0.3
track width trackWidth (default): min 0.127, default 0.254, max 2.54
differential pair differentialPair (default): width min 0.127, default 0.254, max 2.54; gap min 0.152, default 0.152
via viaSize (default): diameter min 0.5, default 0.61, max 10; hole min 0.3, default 0.305, max 6

## Placement (name value [footprint] x y rotation side)
ANT_发射  -  [HDR-TH_1P-V-M_XKB_X4611WV-01I-C28D40]  23.62 17.27 90 top
BAT+  -  [HDR-TH_1P-P2.54-V-M]  3.3 46.74 180 bottom
BAT-  -  [HDR-TH_1P-P2.54-V-M]  22.61 52.32 270 bottom
C5  22pF  [C0805]  4.72 24.26 0 top
C6  22pF  [C0805]  5.02 31.24 180 top
C7  100n  [C0805]  7.8 11.98 90 top
C8  1.5p  [C0805]  16.89 8.51 90 top
C9  1.5p  [C0805]  10.09 8.54 90 top
C10  100n  [C0805]  5.39 11.98 270 top
C11  10uF  [CAP-TH_BD5.0-P2.00-D0.8-FD]  10.16 39.5 180 top
C12  22uF  [C0805#2]  6.1 48.02 90 top
C13  100nF  [C0805#2]  3.3 51.69 90 top
C14  22uF  [C0805#2]  16.89 51.94 270 top
C15  100nF  [C0805#2]  19.18 51.94 270 top
C16  10uF  [CAP-TH_BD5.0-P2.00-D0.8-FD]  18.16 42.67 270 top
C19  100nF  [C0603]  5.93 20 180 top
C20  100nF  [C0603]  18.73 33.66 180 top
C21  1.5p  [C0805]  16.56 16.54 90 top
D1  1N4001  [SMA_L4.2-W2.6-LS5.0-RD]  12.45 34.04 0 bottom
D2  1N4001  [SMA_L4.2-W2.6-LS5.0-RD]  6.99 28.45 270 bottom
D3  1N4001  [SMA_L4.2-W2.6-LS5.0-RD]  14.96 17.14 0 bottom
D4  1N4001  [SMA_L4.2-W2.6-LS5.0-RD]  6.58 11.43 270 bottom
H1  STLink  [HDR-TH_4P-P2.54-V-M]  18.29 38.23 180 top
H2  stm32串口1  [HDR-TH_3P-P2.54-V-M-1]  23.24 24.76 270 top
H10  -  [HDR-TH_1P-V-M_XKB_X4611WV-01I-C28D40]  8.06 16.16 90 top
H11  -  [HDR-TH_2P-P2.54-V-F]  12.57 1.91 0 top
L1  100nH  [IND-SMD_L1.7-W1.0-SCW1608C39NJST]  18.83 17.39 180 top
L2  220nH  [IND-SMD_L1.7-W1.0-SCW1608C39NJST]  14.48 15.49 0 top
L7  22nH  [IND-SMD_L1.7-W1.0-SCW1608C39NJST]  21.11 17.39 180 top
L8  1uH  [IND-SMD_L4.0-W4.0]  10.03 48.89 180 top
LED1  电源指示灯  [LED0805-R-RD]  22.38 43.02 90 bottom
P1  升压后电源跳线  [HDR-TH_2P-P2.54-V-F]  19.18 47.37 180 top
Q1  AO3401  [SOT-23-3_L2.9-W1.6-P1.90-LS2.8-BR]  5.84 41.15 270 bottom
R1  10K  [R0603]  6.33 38.1 0 bottom
R2  20K  [R0805]  5.59 57.15 180 top
R3  4.7k  [R0805]  23.5 47.57 270 top
R4  100k  [R0805]  11.48 18.16 0 top
R5  10k  [R0805]  11.53 16.03 180 top
R6  300K  [R0805]  19.18 56.85 90 top
R7  50K  [RES-ADJ-TH_3P_L9.6-W4.8-P2.50-L]  12.32 58.04 180 top
R8  10k  [R0603]  5.93 21.78 180 top
R9  10k  [R0603]  11.68 34.16 0 top
R10  10k  [R0603]  12.64 20.75 0 top
R11  boot0跳线  [R0603]  13.97 34.92 270 top
R12  10k  [R0603]  20.84 35.56 0 top
R13  10k  [R0603]  16.39 35.56 180 top
R14  100K  [R0805]  6.35 53.97 270 top
R15  10k  [R0603]  17.53 34.04 180 bottom
R16  10k  [R0603]  15.37 19.94 0 bottom
R17  0  [R0805]  3.02 35.26 90 bottom
R18  RST跳线  [R0603]  8.38 21.08 270 top
R19  10k  [R0603]  2.89 38.1 0 bottom
R20  0  [R0805]  3.02 41.15 270 bottom
R21  10k  [R0603]  11.68 35.69 180 top
R22  1k  [R0805]  17.53 2.79 270 top
SW1  MPU6050  [SW-SMD_4P-L6.0-W6.0-P4.50-LS9.0-2]  14.6 12.19 0 bottom
SW2  电源  [SW-TH_MK-12D18-G040]  5.84 44.07 0 top
SW4  MPU6050  [SW-SMD_4P-L6.0-W6.0-P4.50-LS9.0-2]  14.83 28.52 0 bottom
U1  STM32F103C8T6  [LQFP-48_L7.0-W7.0-P0.50-LS9.0-BL]  13.21 27.31 270 top
U2  1N5822  [SMA_L4.3-W2.5-LS5.0-FD]  14.1 51.31 90 top
U3  9p  [C0603]  21.84 15.18 90 top
U4  9p  [C0603]  20.19 15.18 90 top
U5  XL4456  [SOT-23-6_L2.9-W1.6-P0.95-LS2.9-BL]  13.64 12.86 90 top
U6  100p  [C0603]  10.09 12.28 270 top
U7  100nF  [C0603]  8.38 35.69 0 top
U8  PW5300  [SOT-23-6_L2.9-W1.6-P0.95-LS2.8-BL]  9.4 52.96 90 top
U9  XC6219B332MR  [SOT-23-5_L2.9-W1.6-P0.95-LS2.8-BR]  13.46 42.67 0 top
U10  AO3402  [SOT-23-3_L2.9-W1.3-P1.90-LS2.4-BR]  6.45 35.18 180 bottom
U11  100nF  [C0603]  16.7 20.83 180 top
U12  100nF  [C0603]  20.83 30.86 270 top
U13  AO3402  [SOT-23-3_L2.9-W1.3-P1.90-LS2.4-BR]  21.46 5.46 0 top
X1  NX3225SA-26MHz-STD-CSR-6  [CRYSTAL-SMD_4P-L3.2-W2.5-BL]  13.64 8.54 0 top
X3  NX3225SA-26MHz-STD-CSR-6  [CRYSTAL-SMD_4P-L3.2-W2.5-BL]  4.97 27.69 270 top

## Footprints (pads in the part's own frame, mm; a bottom-side part is the same pattern mirrored in y, then rotated)
C0603
  rect 0.8x0.9 smd: 1(-0.7,0) 2(0.7,0)
C0805
  rect 1.41x1.35 smd: 1(-1,0) 2(1,0)
C0805#2
  rect 1.41x1.35 smd: 1(-1.03,0) 2(1.03,0)
CAP-TH_BD5.0-P2.00-D0.8-FD
  round 1.3 hole 0.8: 1(-1.001,0) 2(1.001,0)
CRYSTAL-SMD_4P-L3.2-W2.5-BL
  rect 1.4x1.2 smd: 1(-1.1,-0.85) 2(1.1,-0.85) 3(1.1,0.85) 4(-1.1,0.85)
HDR-TH_1P-P2.54-V-M
  rect 1.7x1.7 hole 1.1: 1(0,0)
HDR-TH_1P-V-M_XKB_X4611WV-01I-C28D40
  rect 1.399x1.399 hole 0.899: 1(0,0)
HDR-TH_2P-P2.54-V-F
  rect 1.999x1.999 hole 1.199: 1(-1.27,0)
  round 1.999 hole 1.199: 2(1.27,0)
HDR-TH_3P-P2.54-V-M-1
  rect 1.575x1.801 hole 1.199: 1(-2.54,0)
  round 1.801 hole 1.199: 2(0,0) 3(2.54,0)
HDR-TH_4P-P2.54-V-M
  rect 1.7x1.7 hole 1.1: 1(-3.81,0)
  round 1.7 hole 1.1: 2(-1.27,0) 3(1.27,0) 4(3.81,0)
IND-SMD_L1.7-W1.0-SCW1608C39NJST
  rect 0.5x1.1 smd: 1(-0.65,0) 2(0.65,0)
IND-SMD_L4.0-W4.0
  rect 1.6x3.5 smd: 1(-1.6,0) 2(1.6,0)
LED0805-R-RD
  rect 1x1.399 smd: 1(1.05,0) 2(-1.05,0)
LQFP-48_L7.0-W7.0-P0.50-LS9.0-BL
  oval 0.27x1.5 smd: 1(-2.75,-4.25) 2(-2.25,-4.25) 3(-1.75,-4.25) 4(-1.25,-4.25) 5(-0.75,-4.25) 6(-0.25,-4.25) 7(0.25,-4.25) 8(0.75,-4.25) 9(1.25,-4.25) 10(1.75,-4.25) 11(2.25,-4.25) 12(2.75,-4.25) 25(2.75,4.25) 26(2.25,4.25) 27(1.75,4.25) 28(1.25,4.25) 29(0.75,4.25) 30(0.25,4.25) 31(-0.25,4.25) 32(-0.75,4.25) 33(-1.25,4.25) 34(-1.75,4.25) 35(-2.25,4.25) 36(-2.75,4.25)
  oval 1.5x0.27 smd: 13(4.25,-2.75) 14(4.25,-2.25) 15(4.25,-1.75) 16(4.25,-1.25) 17(4.25,-0.75) 18(4.25,-0.25) 19(4.25,0.25) 20(4.25,0.75) 21(4.25,1.25) 22(4.25,1.75) 23(4.25,2.25) 24(4.25,2.75) 37(-4.25,2.75) 38(-4.25,2.25) 39(-4.25,1.75) 40(-4.25,1.25) 41(-4.25,0.75) 42(-4.25,0.25) 43(-4.25,-0.25) 44(-4.25,-0.75) 45(-4.25,-1.25) 46(-4.25,-1.75) 47(-4.25,-2.25) 48(-4.25,-2.75)
R0603
  rect 0.806x0.864 smd: 1(-0.753,0) 2(0.753,0)
R0805
  rect 1.133x1.377 smd: 1(-0.966,0) 2(0.966,0)
RES-ADJ-TH_3P_L9.6-W4.8-P2.50-L
  round 1.524 hole 0.762: 1(-2.55,0) 2(-0.01,0) 3(2.55,0)
SMA_L4.2-W2.6-LS5.0-RD
  rect 2x1.8 smd: 1(-2.06,0) 2(2.06,0)
SMA_L4.3-W2.5-LS5.0-FD
  rect 2.184x1.593 smd: 1(-2.443,0) 2(2.443,0)
SOT-23-3_L2.9-W1.3-P1.90-LS2.4-BR
  rect 1.25x0.7 smd: 1(1,-0.95) 2(1,0.95) 3(-1,0)
SOT-23-3_L2.9-W1.6-P1.90-LS2.8-BR
  rect 1.07x0.6 smd: 1(1.235,-0.95) 2(1.235,0.95) 3(-1.235,0)
SOT-23-5_L2.9-W1.6-P0.95-LS2.8-BR
  rect 1.001x0.6 smd: 1(1.1,-0.95) 2(1.1,0) 3(1.1,0.95) 4(-1.1,0.95) 5(-1.1,-0.95)
SOT-23-6_L2.9-W1.6-P0.95-LS2.8-BL
  rect 0.532x1.072 smd: 1(-0.95,-1.149) 2(0,-1.149) 3(0.95,-1.149) 4(0.95,1.149) 5(0,1.149) 6(-0.95,1.149)
SOT-23-6_L2.9-W1.6-P0.95-LS2.9-BL
  rect 0.532x1.072 smd: 1(-0.95,-1.149) 2(0,-1.149) 3(0.95,-1.149) 4(0.95,1.149) 5(0,1.149) 6(-0.95,1.149)
SW-SMD_4P-L6.0-W6.0-P4.50-LS9.0-2
  rect 2.3x1.5 smd: 1(-4.55,2.25) 2(4.55,2.25) 3(-4.55,-2.25) 4(4.55,-2.25)
SW-TH_MK-12D18-G040
  oval 1.5x1.1 hole 1x0.6: 1(-2.5,0) 2(0,0) 3(2.5,0)

## Nets
As in the schematic, except:
GND: BAT-.1 C5.1 C6.1 C7.1 C8.1 C9.2 C10.2 C11.2 C12.2 C13.2 C14.2 C15.2 C16.2 C19.2 C20.2 H1.4 H2.3 R2.2 R3.1 R4.1 R7.2 R9.1 R10.1 R13.2 R18.2 R19.1 SW1.1 SW4.1 U1.8 U1.23 U1.35 U1.47 U3.1 U4.1 U5.2 U6.2 U7.1 U8.2 U9.2 U10.2 U11.1 U12.1 U13.2 X1.2 X1.4 X3.2 X3.4
$2N813: C8.2 U5.1 X1.3
$2N814: C9.1 U5.6 X1.1

Pads without a net: R7 3; SW1 2 4; SW2 3; SW4 2 4; U1 2 3 4 10 11 12 13 16 17 20 21 22 25 26 27 28 29 32 33 38 39 40 41 42 43; U9 4

## Via types
v1: diameter 0.61, hole 0.305, Top Layer to Bottom Layer, 96 vias

## Routing (per net, layer and track width the routed paths; a pad name or vN(x,y) marks a point on that pad's centre or on a via; arc(x,y) is an arc through that point)
3V3: length 157.1
  Top Layer w0.203: 17.56,30.06 17.53,30.09 17.53,30.73 19.43,32.64 C20.1 20.83,33.66 21.59,34.42 R12.2 21.59,36.45 22.1,36.96 v1(22.1,38.23) ; 17.56,30.06 20.72,30.06 U12.2 ; 17.56,30.06 U1.36 16.09,30.06 15.11,29.08 15.11,25.27 15.96,24.43 U1.24 15.96,20.92 16.1,20.78 ; U7.2 R21.2 ; U7.2 9.08,37.42 C11.1 ; U7.2 9.08,34.34 10.46,32.96 10.46,31.56 U1.48 U1.1 ; U7.2 6.8,33.4 3.56,33.4 1.91,31.75 1.91,14.99 3.91,12.98 5.24,12.98 ; U1.9 8.94,26.07 7.65,26.07 7.11,25.53 7.11,23.24 6.73,22.86 5.46,22.86 5.17,22.57 R8.2 3.81,20.42 3.81,16.38 5.39,14.8 C10.1 C7.2 U6.1 11.15,12.98 11.3,12.83 12.46,12.83 U5.5 13.37,12.86 13.84,13.34 13.84,15.48 L2.1
  Top Layer w0.381: C10.1 5.24,12.98 2.03,9.78 2.03,7.11 7.24,1.91 H11.1
  Top Layer w0.508: U9.5 12.36,40.7 C11.1
  Bottom Layer w0.203: R16.1 14.61,24.27 14.99,24.64 14.99,29.34 18.28,32.63 R15.1 18.28,35.44 17.27,36.45 12.19,36.45 11.16,37.48 C11.1
  Bottom Layer w0.381: v1(22.1,38.23) 20.83,39.5 C11.1
5V: length 16.1
  Top Layer w0.508: U9.1 16.21,41.72 18.11,43.62 ; 18.11,43.62 v1(18.16,43.67) 18.16,47.12 P1.2 ; 18.11,43.62 U9.3
  Bottom Layer w0.127: v1(18.16,43.67) 20.31,43.67 20.7,44.07 LED1.1
GND: length 9.6
  Top Layer w0.203: U1.23 15.46,22.06 14.86,21.46 ; 10.16,26.03 9.64,26.56 U1.8 ; U1.35 16.73,29.56 16.13,28.96 ; 10.92,29.46 10.96,29.5 U1.47 10.96,34.14 R9.1
  vias: v1(0.63,51.18) v1(0.63,48.64) v1(0.63,46.1) v1(0.63,43.56) v1(0.63,41.02) v1(0.63,38.48) v1(0.63,35.94) v1(0.63,33.4) v1(0.63,30.86) v1(0.63,28.32) v1(0.63,25.78) v1(0.63,23.24) v1(0.63,20.7) v1(0.63,18.16) v1(0.63,15.62) v1(0.63,13.08) v1(1.02,9.91) v1(3.18,56.26) v1(3.18,20.7) v1(3.18,18.16) v1(3.18,15.62) v1(3.18,8) v1(3.56,3.81) v1(5.46,5.72) v1(5.72,58.8) v1(5.72,41.02) v1(5.72,18.16) v1(5.72,15.62) v1(7.87,23.5) v1(8.25,58.8) v1(8.25,56.26) v1(8.25,51.18) v1(8.25,46.1) v1(8.25,41.02) v1(8.25,38.48) v1(8.25,33.4) v1(8.25,8) v1(8.25,5.46) v1(10.37,25.95) v1(10.8,58.8) v1(10.8,46.1) v1(10.8,43.56) v1(10.8,41.02) v1(10.8,5.46) v1(11.3,28.32) v1(13.08,24.89) v1(13.34,58.8) v1(13.34,51.18) v1(13.34,46.1) v1(13.34,43.56) v1(13.34,41.02) v1(13.34,28.57) v1(13.34,5.46) v1(15.88,58.8) v1(15.88,56.26) v1(15.88,48.64) v1(15.88,46.1) v1(15.88,26.67) v1(15.88,13.08) v1(15.88,5.46) v1(18.41,23.24) v1(18.41,20.7) v1(18.41,8) v1(18.41,5.46) v1(19.81,2.41) v1(20.96,58.8) v1(20.96,56.26) v1(20.96,53.72) v1(20.96,41.02) v1(20.96,28.32) v1(20.96,23.24) v1(20.96,20.7) v1(20.96,10.54) v1(20.96,8) v1(23.5,56.26) v1(23.5,53.72) v1(23.5,41.02) v1(23.5,38.48) v1(23.5,35.94) v1(23.5,33.4) v1(23.5,30.86) v1(23.5,20.7) v1(23.5,10.54) v1(23.75,7.87)
VCC-ZJ: length 15.3
  Top Layer w0.762: P1.1 20.83,47.75 20.83,52.2 20.05,52.97 C15.1 ; U2.2 16.11,53.75 C14.1 C15.1 ; C15.1 R6.1
433_OUT: length 12.9
  Top Layer w0.203: U1.18 12.96,21.95 12.57,21.56 12.57,19.94 12.06,19.43 9.65,19.43 8.06,17.84 H10.1 10.44,16.16 R5.2
BAT: length 24.7
  Top Layer w0.254: U8.5 8.2,53.01 R14.2 5.65,53.01 C13.1
  Top Layer w0.762: SW2.2 5.84,46.59 ; L8.2 6.67,50.66 C13.1 3.3,49.4 5.72,46.99 C12.1
  Bottom Layer w0.762: Q1.3 SW2.2 3.89,42.11 R20.1
BAT_KEY: length 38.9
  Bottom Layer w0.203: Q1.1 6.86,39.85 6.86,38.33 R1.2 7.45,37.73 U10.3 7.49,35.13 7.49,34.04 5.33,31.88 5.33,29.08 6.99,27.43 D2.2 4.29,26.39 2.54,24.64 2.54,11.05 4.22,9.37 D4.2
BAT_MCU: length 16.5
  Top Layer w0.203: v1(9.91,36.96) 11.43,36.96 11.68,36.7 11.68,32.89 11.46,32.66 U1.46 ; v1(8.38,36.96) 6.1,36.96 5.36,36.22 v1(3.02,36.22)
  Bottom Layer w0.203: v1(9.91,36.96) v1(8.38,36.96) ; v1(3.02,36.22) 3.65,36.85 R19.2
BOOT0: length 4.2
  Top Layer w0.203: R11.2 13.96,34.16 R9.2 12.46,34.14 U1.44
BOOT1: length 2.3
  Top Layer w0.203: R10.2 13.46,20.81 U1.19
CLOSE: length 14.3
  Top Layer w0.203: U1.15 11.46,22.13 10.41,21.08 v1(10.41,20.57)
  Bottom Layer w0.203: v1(10.41,20.57) 12.06,18.92 13.59,18.92 15.37,17.14 D3.2 17.02,19.43 16.51,19.94 R16.2
IR: length 48.8
  Top Layer w0.203: U13.1 22.73,4.78 v1(22.73,5.46) ; v1(13.97,25.91) 13.84,25.91 11.96,27.79 U1.45
  Bottom Layer w0.203: v1(13.97,25.91) 13.97,23.37 12.7,22.1 10.44,22.1 4.06,15.72 4.06,12.57 5.21,11.43 6.99,11.43 8.13,10.29 8.13,9.17 10.31,6.98 21.46,6.98 22.73,5.72 v1(22.73,5.46)
NRST: length 11.6
  Top Layer w0.203: U1.7 10.56,27.06 11.03,26.58 11.03,25.08 8.38,22.43 R18.1 8.33,21.78 R8.1 6.68,20.05 C19.1
OPEN: length 14.8
  Top Layer w0.203: U1.14 10.96,24.42 11.81,25.27 v1(11.94,25.27)
  Bottom Layer w0.203: v1(11.94,25.27) 14.1,27.43 14.1,33.63 D1.2 R15.2
OSC_IN: length 8.1
  Top Layer w0.203: U1.5 7.1,28.06 6.73,27.69 4.95,27.69 4.12,28.52 X3.1 4.12,31.14 C6.2
OSC_OUT: length 5.9
  Top Layer w0.203: U1.6 7.62,27.56 6.65,26.59 X3.3 5.82,24.36 C5.2
STM32_RDX: length 6
  Top Layer w0.203: 23.24,27.31 23.11,27.18 21.08,27.18 20.71,27.56 U1.31
STM32_TDX: length 6.7
  Top Layer w0.203: U1.30 20.44,27.06 22.73,24.76 H2.2
SWCLK: length 7.3
  Top Layer w0.203: H1.3 17.02,35.56 R13.1 17.15,34.29 15.96,33.1 U1.37
SWDIO: length 17.5
  Top Layer w0.203: R12.1 20.08,36.43 19.56,36.96 19.56,38.23 ; v1(22.22,33.02) 22.22,29.84 21.42,29.04 17.47,29.04 U1.34
  Bottom Layer w0.203: v1(22.22,33.02) 19.56,35.69 19.56,38.23
$1N2585: length 1.5
  Top Layer w0.203: R21.1 13.96,35.69 R11.1
$1N7140: length 4.3
  Top Layer w0.381: U13.3 20.45,5.44 20.45,4.32 19.89,3.76 R22.1
$1N7169: length 3.7
  Top Layer w0.381: H11.2 17.45,1.91 R22.2
$2N807: length 3.4
  Top Layer w0.203: U3.2 21.84,17.31 L7.1 23.51,17.39 ANT_发射.1
$2N808: length 2.6
  Top Layer w0.203: U4.2 20.46,16.15 L7.2 20.45,17.4 19.49,17.4 L1.1
$2N809: length 1.7
  Top Layer w0.203: L1.2 18.04,17.53 16.58,17.53 C21.2
$2N810: length 3.4
  Top Layer w0.203: C21.1 16.52,15.49 L2.2 15.11,15.48 15.11,13.84 15.08,13.81 U5.3
$2N813: length 4.7
  Top Layer w0.203: U5.1 14.79,9.44 X1.3 16.77,9.39 C8.2
$2N814: length 7.7
  Top Layer w0.203: C9.1 12.39,7.54 X1.1 12.64,7.69 13.59,8.63 13.59,10 12.45,11.15 12.45,11.86 U5.6
$2N822: length 4.4
  Top Layer w0.203: R4.2 12.5,18.11 R5.1 12.5,13.81 U5.4
$3N1267: length 6
  Top Layer w0.762: 10.55,52.01 11.63,50.92 L8.1 14.07,48.89 U2.1
$3N1270: length 2.7
  Top Layer w0.254: R14.1 7.8,54.94 8.25,54.48 8.25,53.91 U8.4
$3N1272: length 8.4
  Top Layer w0.254: 8.25,52.01 9.08,52.01 9.4,52.32 9.4,56.13 8.38,57.15 R2.1
$3N1276: length 11.3
  Top Layer w0.762: U8.3 10.55,55.38 11.43,56.26 13.09,56.26 R7.1 15,57.91 19.08,57.91 R6.2
$3N1281: length 6.3
  Top Layer w0.127: R3.2 23.5,45.59 24.13,44.96 v1(24.13,44.2)
  Bottom Layer w0.127: v1(24.13,44.2) 24.13,42.55 23.55,41.97 LED1.2
$3N5242: length 13.1
  Top Layer w0.762: BAT+.1 3.34,46.7 SW2.1
  Bottom Layer w0.203: R1.1 5.58,39.23 Q1.2
  Bottom Layer w0.762: Q1.2 4.62,40.18 R20.2 2.11,40.18 1.65,40.64 1.65,43.43 2.29,44.07 SW2.1
$3N6252: length 6.7
  Bottom Layer w0.203: D2.1 10.02,30.51 10.39,30.87 D1.1
$3N7467: length 7.8
  Bottom Layer w0.203: D4.1 7.53,14.44 SW1.3 10.19,14.44 D3.1
$3N7940: length 2.5
  Bottom Layer w0.203: U10.1 5.39,34.29 R17.1

## Copper pours and planes (outline as drawn; the poured copper is in the pictures)
GND on Top Layer: -6.22,68.45 29.97,68.45 29.97,-2.03 -6.22,-2.03
GND on Bottom Layer: -4.32,66.8 28.58,66.8 28.58,0.63 -4.32,0.63

Small or netless copper shapes (teardrops, artwork), in the pictures only: 137 on Top Layer, 54 on Bottom Layer

## Text on the board
Bottom Silkscreen Layer: V / D / C / G | CLOSE | OPEN
Top Silkscreen Layer: R / T / G
